# EAGLE schematic control_unit (EAGLE 8.4.3)
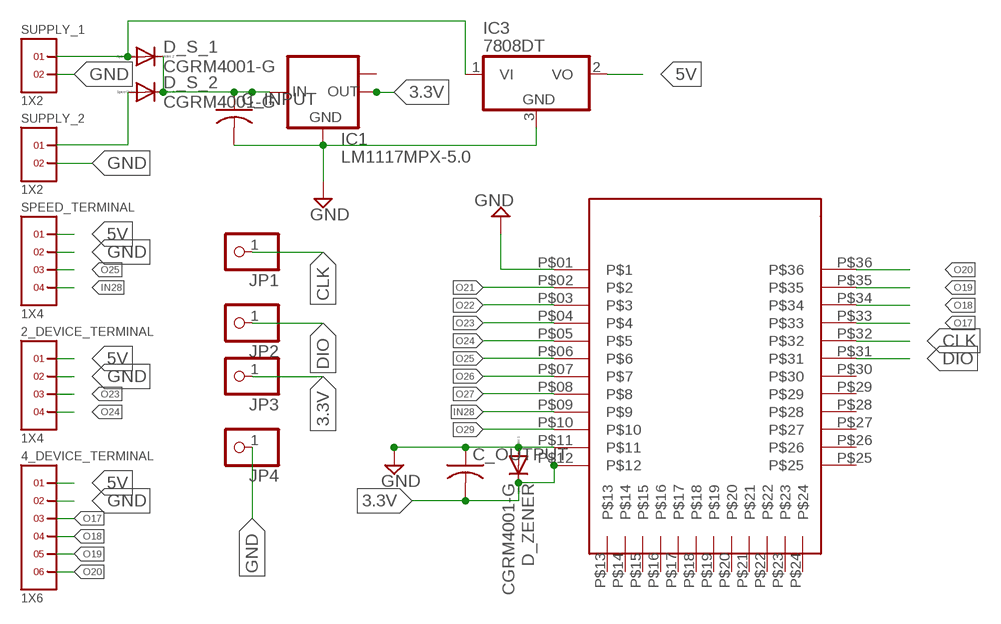
[diagram p0: schematic, sheet 1]

## Parts
2_DEVICE_TERMINAL  1X4  [1X4]
4_DEVICE_TERMINAL  1X6  [1X6]
C_INPUT  C-USC1206  [C1206]
C_OUTPUT  C-USC1206  [C1206]
D_S_1  CGRM4001-G  [SOD-123_MINI-SMA]
D_S_2  CGRM4001-G  [SOD-123_MINI-SMA]
D_ZENER  CGRM4001-G  [SOD-123_MINI-SMA]
IC1  LM1117MPX-5.0  [SOT223]
IC3  7808DT  [TO252]
JP1  PINHD-1X1  [1X01]
JP2  PINHD-1X1  [1X01]
JP3  PINHD-1X1  [1X01]
JP4  PINHD-1X1  [1X01]
SPEED_TERMINAL  1X4  [1X4]
SUPPLY_1  1X2  [1X2]
SUPPLY_2  1X2  [1X2]
U$1  HZX_MODULE  [SMD_PAD_VERSION]

## Nets
3.3V: C_OUTPUT.2 D_ZENER.C IC1.2(OUT) JP3.1 U$1.P$12
5V: 2_DEVICE_TERMINAL.1 4_DEVICE_TERMINAL.1 IC3.2(VO) SPEED_TERMINAL.1
CLK: JP1.1 U$1.P$32
DIO: JP2.1 U$1.P$31
GND: 2_DEVICE_TERMINAL.2 4_DEVICE_TERMINAL.2 C_INPUT.2 C_OUTPUT.1 D_ZENER.A IC1.1(GND) IC3.3(GND) JP4.1 SPEED_TERMINAL.2 SUPPLY_1.2 SUPPLY_2.2 U$1.P$01 U$1.P$11
IN28: SPEED_TERMINAL.4 U$1.P$09
N$2: D_S_1.A IC3.1(VI) SUPPLY_1.1
N$3: C_INPUT.1 D_S_1.C D_S_2.C IC1.3(IN)
N$6: D_S_2.A SUPPLY_2.1
O17: 4_DEVICE_TERMINAL.3 U$1.P$33
O18: 4_DEVICE_TERMINAL.4 U$1.P$34
O19: 4_DEVICE_TERMINAL.5 U$1.P$35
O20: 4_DEVICE_TERMINAL.6 U$1.P$36
O21: U$1.P$02
O22: U$1.P$03
O23: 2_DEVICE_TERMINAL.3 U$1.P$04
O24: 2_DEVICE_TERMINAL.4 U$1.P$05
O25: SPEED_TERMINAL.3 U$1.P$06
O26: U$1.P$07
O27: U$1.P$08
O29: U$1.P$10
Unconnected: IC1.TAB(OUT1) U$1.P$13 U$1.P$14 U$1.P$15 U$1.P$16 U$1.P$17 U$1.P$18 U$1.P$19 U$1.P$20 U$1.P$21 U$1.P$22 U$1.P$23 U$1.P$24 U$1.P$25 U$1.P$26 U$1.P$27 U$1.P$28 U$1.P$29 U$1.P$30

## Library data of the parts
2_DEVICE_TERMINAL SPEED_TERMINAL = headers(2mm)(samtec):1X4
4_DEVICE_TERMINAL = headers(2mm)(samtec):1X6
C_INPUT C_OUTPUT = resistor:C-US: CAPACITOR, American symbol
D_S_1 D_S_2 D_ZENER = diode:CGRM400*-G: Molded plasitc,JEDEC SOD-123/Mini SMA Source: Comchip CGRM4001-G.pdf
IC1 = lm1117:LM1117MPX-*
IC3 = linear:78*: Positive VOLTAGE REGULATOR Source: http://cache.national.com/ds/LM/LM78L05.pdf http://www.fairchildsemi.com/ds/LM/LM7805.pdf
JP1-JP4 = pinhead:PINHD-1X1: PIN HEADER
SUPPLY_1 SUPPLY_2 = headers(2mm)(samtec):1X2
U$1 = HZX_MODULE:HZX_MODULE; AUTHOR: Agam